# EAGLE schematic Pedal Box Board rev1 (EAGLE 7.7.0)
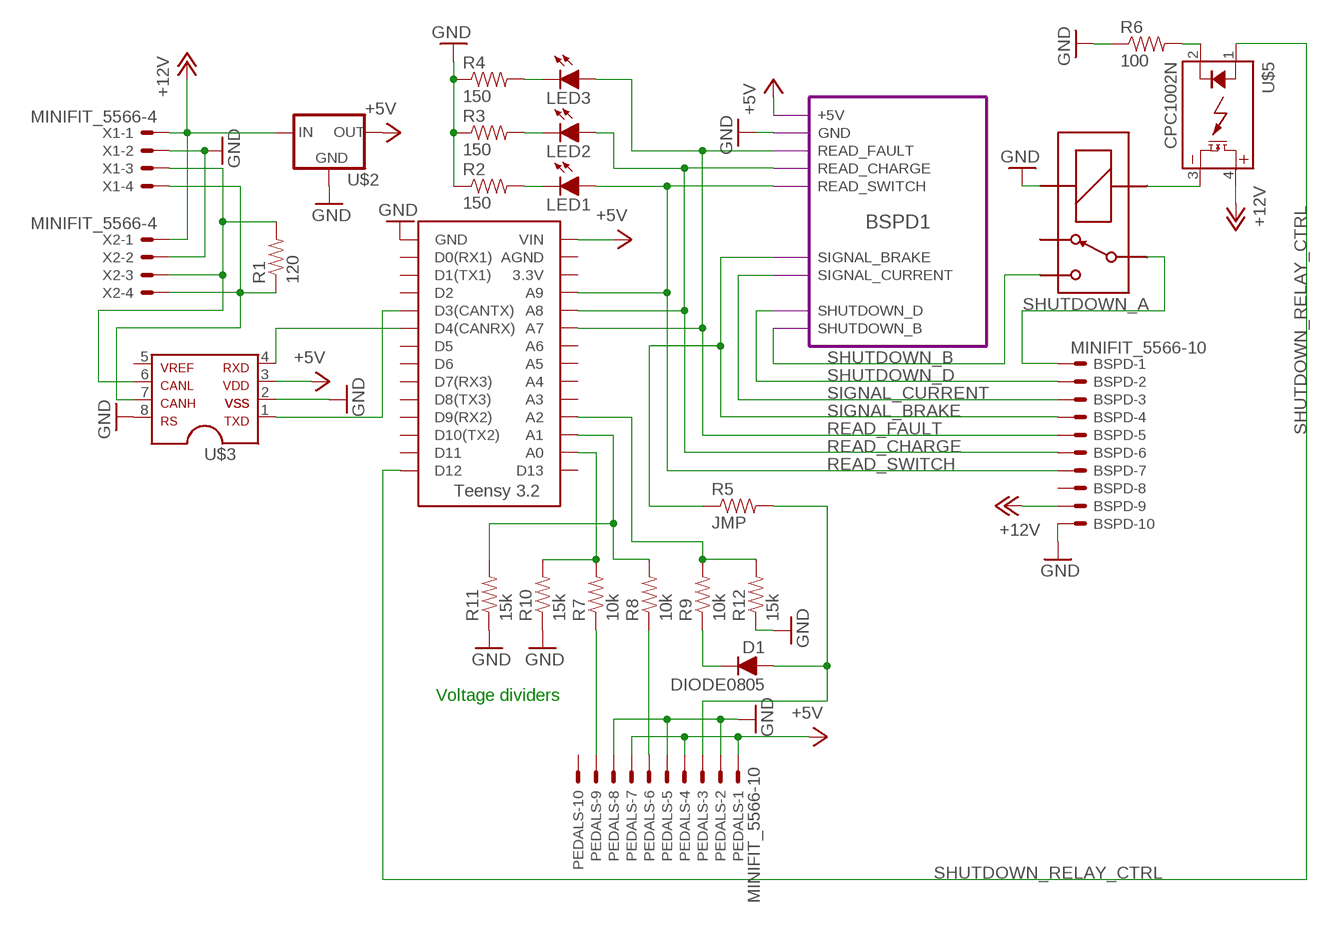
[diagram p0: schematic, sheet 1]

## Parts
BSPD  MINIFIT_5566-10  [MINIFIT_5566-10]
D1  DIODE0805  [0805_D]
LED1  LED-0805  [LED-805]
LED2  LED-0805  [LED-805]
LED3  LED-0805  [LED-805]
PEDALS  MINIFIT_5566-10  [MINIFIT_5566-10]
R1  120  RESISTOR0805-RES  [0805]
R2  150  RESISTOR0805-RES  [0805]
R3  150  RESISTOR0805-RES  [0805]
R4  150  RESISTOR0805-RES  [0805]
R5  JMP  RESISTORPTH-1/4W-VERT  [AXIAL-0.1]
R6  100  RESISTOR0805-RES  [0805]
R7  10k  RESISTOR0805-RES  [0805]
R8  10k  RESISTOR0805-RES  [0805]
R9  10k  RESISTOR0805-RES  [0805]
R10  15k  RESISTOR0805-RES  [0805]
R11  15k  RESISTOR0805-RES  [0805]
R12  15k  RESISTOR0805-RES  [0805]
SOFTWARE_SHUTOFF  G5LE  [ZF112]
U$1  TEENSY_3.2_SIMPLE  [TEENSY_3.2_SIMPLE]
U$2  5VREG_LM340-NLM340MPX-5.0/NOPB  [SOT223]
U$3  MCP2551  [SOIC-08]
U$5  CPC1002N  [SOP04]
X1  MINIFIT_5566-4  [MINIFIT_5566-4]
X2  MINIFIT_5566-4  [MINIFIT_5566-4]

## Module instances
BSPD1 = BSPD

## Nets
+5V: PEDALS.1 PEDALS.4 PEDALS.7 U$1.VIN U$2.3(OUT) U$3.3 ; port BSPD1.+5V
+12V: BSPD.9 U$2.1(IN) U$5.4(DC+) X1.1 X2.1
GND: BSPD.10 PEDALS.2 PEDALS.5 PEDALS.8 R2.1 R3.1 R4.1 R6.1 R10.1 R11.1 R12.1 SOFTWARE_SHUTOFF.1(COIL+) U$1.GND U$2.2(GND) U$2.4(GND) U$3.2 U$3.8 X1.2 X2.2 ; port BSPD1.GND
N$1: PEDALS.9 R7.1
N$2: U$1.D4(CANRX) U$3.4
N$3: R1.2 U$3.6 X1.3 X2.3
N$4: R1.1 U$3.7 X1.4 X2.4
N$5: U$1.D3(CANTX) U$3.1
N$6: R8.2 R11.2 U$1.A1
N$7: D1.C R9.1
N$8: PEDALS.6 R8.1
N$9: R7.2 R10.2 U$1.A0
N$10: R9.2 R12.2 U$1.A2
N$11: D1.A PEDALS.3 R5.P$2
N$12: SOFTWARE_SHUTOFF.2(COIL-) U$5.3(DC-)
N$14: LED1.C R2.2
N$15: LED2.C R3.2
N$16: LED3.C R4.2
N$22: R6.2 U$5.2(CONTROL-)
READ_CHARGE: BSPD.6 LED2.A U$1.A8 ; port BSPD1.READ_CHARGE
READ_FAULT: BSPD.5 LED3.A U$1.A7 ; port BSPD1.READ_FAULT
READ_SWITCH: BSPD.7 LED1.A U$1.A9 ; port BSPD1.READ_SWITCH
SHUTDOWN_A: BSPD.1 SOFTWARE_SHUTOFF.P
SHUTDOWN_B: SOFTWARE_SHUTOFF.S ; port BSPD1.SHUTDOWN_B
SHUTDOWN_D: BSPD.2 ; port BSPD1.SHUTDOWN_D
SHUTDOWN_RELAY_CTRL: U$1.D12 U$5.1(CONTROL+)
SIGNAL_BRAKE: BSPD.4 R5.P$1 ; port BSPD1.SIGNAL_BRAKE
SIGNAL_CURRENT: BSPD.3 ; port BSPD1.SIGNAL_CURRENT
Unconnected: BSPD.8 PEDALS.10 SOFTWARE_SHUTOFF.O U$1.3.3V U$1.A3 U$1.A4 U$1.A5 U$1.A6 U$1.AGND U$1.D0(RX1) U$1.D1(TX1) U$1.D2 U$1.D5 U$1.D6 U$1.D7(RX3) U$1.D8(TX3) U$1.D9(RX2) U$1.D10(TX2) U$1.D11 U$1.D13 U$3.5

## Notes on the sheet
- Voltage dividers

## Library data of the parts
BSPD PEDALS = HyTechDevices:MINIFIT_5566-10: Mini-Fit Junior connector 10 pole Source: http://www.molex.com; OC_FARNELL: unknown; OC_NEWARK: unknown
D1 = HyTechDevices:DIODE: DIODE general purpose rectifier
LED1-LED3 = HyTechDevices:LED: Light Emitting Diode (LED) Source: Dangerous Prototypes Eagle Library <https://github.com/DangerousPrototypes/Eagle_Part_Library>
R1-R12 = HyTechDevices:RESISTOR: Resistor Basic schematic elements and footprints for 0603, 1206, and PTH resistors.
SOFTWARE_SHUTOFF = HyTechDevices:G5LE: Omron G5LE SPST Relay 5 VDC, 12VDC, 24VDC models Coil voltage: 75% - 170% of nominal voltage Datasheet <https://www.omron.com/ecb/products/pdf/en-g5le.pdf>
U$1 = HyTechDevices:TEENSY_3.2_SIMPLE: Simple version of the Teensy 3.2 board that only uses the 2 main rows of pins, not the inner pins or the pins opposite the usb port.
U$2 = HyTechDevices:5VREG_LM340-N: Voltage Regulator 5v linear voltage regulator Datasheet <http://www.mouser.com/ProductDetail/Texas-Instruments/LM340MPX-50-NOPB/?qs=X1J7HmVL2ZGZwtTFRQ9ItA%3D%3D> MAX current out: 1.5A MAX voltage in: 35V
U$3 = HyTechDevices:MCP2551: MCP2551 High-Speed CAN Transceiver Product Webpage <https://www.microchip.com/wwwproducts/en/MCP2551> Datasheet <http://ww1.microchip.com/downloads/en/DeviceDoc/21667f.pdf> This device is outdated It is replaced by MCP2561. Comparison Page <https://www.microchip.com/wwwproducts/ProductCompare/MCP2551/MCP2561> Product Webpage <https://www.microchip.com/wwwproducts/en/MCP2561> Datasheet <http://ww1.microchip.com/downloads/en/DeviceDoc/20005167C.pdf>
U$5 = HyTechDevices:CPC1002N: IXYS Solid State Relay .7A
X1 X2 = HyTechDevices:MINIFIT_5566-4: Mini-Fit Junior connector 4 pole Source: http://www.molex.com; OC_FARNELL: unknown; OC_NEWARK: unknown

## Module BSPD
Ports: GND(out) +5V(in) READ_CHARGE(out) SHUTDOWN_B(in) READ_SWITCH(out) READ_FAULT(out) SHUTDOWN_D(out) SIGNAL_BRAKE(in) SIGNAL_CURRENT(in)
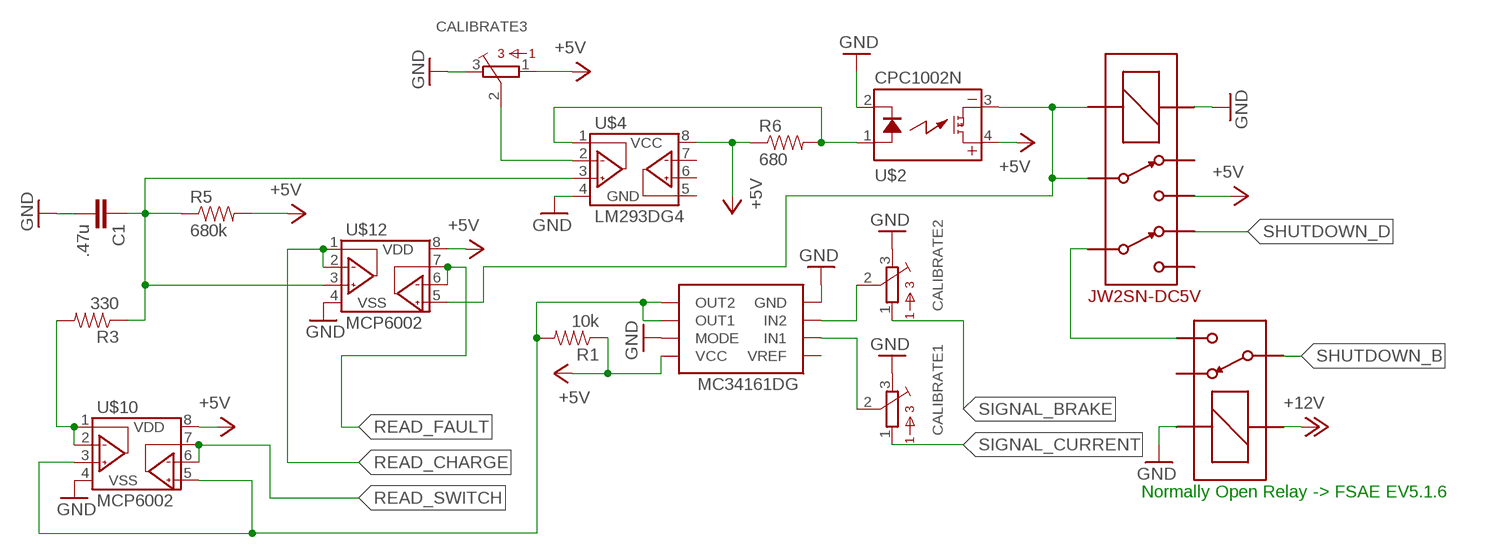
[diagram p1: schematic, module BSPD, sheet 1]

### Parts
C1  .47u  CAPEZ  [CAP-PTH-SMALLEZ]
CALIBRATE1  TRIMPOT_3296C  [TRIMPOT_3296]
CALIBRATE2  TRIMPOT_3296C  [TRIMPOT_3296]
CALIBRATE3  TRIMPOT_3296C  [TRIMPOT_3296]
MC34161DG  MC34161DG  [SOIC-08]
R1  10k  RESISTOR0805-RES  [0805]
R3  330  RESISTOR0805-RES  [0805]
R5  680k  RESISTOREZ  [AXIAL-0.3EZ]
R6  680  RESISTOR0805-RES  [0805]
U$1  G5LE  [ZF112]
U$2  CPC1002N  [SOP04]
U$3  DPDT_RELAY_PANASONIC_JW2SN-DC5V  [DPDT_RELAY_PANASONIC_JW2SN]
U$4  LM293DG4  [SOIC-08]
U$10  MCP6002  [SOIC-08]
U$12  MCP6002  [SOIC-08]

### Nets
+5V: CALIBRATE3.1 MC34161DG.8(VCC) R1.1 R5.P$2 R6.1 U$2.4(DC+) U$3.4 U$4.8(VCC) U$10.8(VDD) U$12.8(VDD)
+12V: U$1.2(COIL-)
GND: C1.2 CALIBRATE1.3 CALIBRATE2.3 CALIBRATE3.3 MC34161DG.4(GND) MC34161DG.7(MODE) U$1.1(COIL+) U$2.2(CONTROL-) U$3.COIL+ U$4.4(GND) U$10.4(VSS) U$12.4(VSS)
N$1: U$2.3(DC-) U$3.3 U$3.COIL- U$12.5(VINB+)
N$4: R3.2 U$10.1(VOUTA) U$10.2(VINA-)
N$5: CALIBRATE2.2 MC34161DG.3(IN2)
N$6: CALIBRATE1.2 MC34161DG.2(IN1)
N$7: CALIBRATE3.2 U$4.2(1IN-)
N$9: R6.2 U$2.1(CONTROL+) U$4.1(1OUT)
N$10: MC34161DG.5(OUT2) MC34161DG.6(OUT1) R1.2 U$10.3(VINA+) U$10.5(VINB+)
N$13: C1.1 R3.1 R5.P$1 U$4.3(1IN+) U$12.3(VINA+)
READ_CHARGE: U$12.1(VOUTA) U$12.2(VINA-)
READ_FAULT: U$12.6(VINB-) U$12.7(VOUTB)
READ_SWITCH: U$10.6(VINB-) U$10.7(VOUTB)
SHUTDOWN_B: U$1.P
SHUTDOWN_C: U$1.S U$3.6
SHUTDOWN_D: U$3.7
SIGNAL_BRAKE: CALIBRATE2.1
SIGNAL_CURRENT: CALIBRATE1.1
Unconnected: MC34161DG.1(VREF) U$1.O U$3.2 U$3.5 U$4.5(2IN+) U$4.6(2IN-) U$4.7(2OUT)

### Notes on the sheet
- Normally Open Relay -> FSAE EV5.1.6

### Library data of the parts
C1 = HyTechDevices:CAP: Capacitor Standard 0603 ceramic capacitor, and 0.1" leaded capacitor.
CALIBRATE1-CALIBRATE3 = HyTechDevices:TRIMPOT_3296: 3296 Series 3/8" Square Trimmer Source <https://github.com/chiengineer/Eagle-Libraries/blob/master/Potentiometers/bourns.lbr>
MC34161DG = HyTechDevices:MC34161DG: ON Semiconductor MC34161 Dual Channel Voltage Monitor
R1 R3 R5 R6 = HyTechDevices:RESISTOR: Resistor Basic schematic elements and footprints for 0603, 1206, and PTH resistors.
U$1 = HyTechDevices:G5LE: Omron G5LE SPST Relay 5 VDC, 12VDC, 24VDC models Coil voltage: 75% - 170% of nominal voltage Datasheet <https://www.omron.com/ecb/products/pdf/en-g5le.pdf>
U$2 = HyTechDevices:CPC1002N: IXYS Solid State Relay .7A
U$3 = HyTechDevices:DPDT_RELAY_PANASONIC_JW2SN-DC5V: Double Pull Double Throw Relay 5VDC Datasheet <http://www.mouser.com/ds/2/316/jw-catalog-461998.pdf> Product Page <http://www.mouser.com/ProductDetail/Panasonic-Industrial-Devices/JW2SN-DC5V>
U$4 = HyTechDevices:LM293: Texas Instruments LM293 Dual Differential Comparator
U$10 U$12 = HyTechDevices:MCP6002: Microchip MCP6002 Dual Channel Op Amp